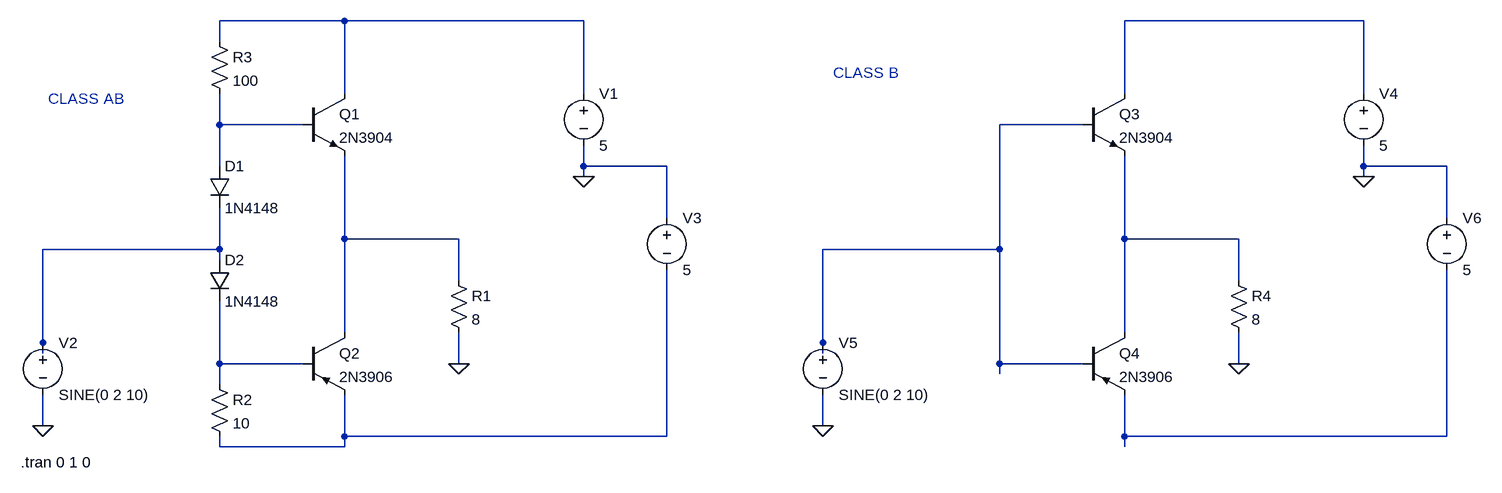
[diagram p0: schematic ClassBvsClassAB.asc]
ClassBvsClassAB.asc, the LTspice schematic file:
Version 4
SHEET 1 1948 680
WIRE 192 -96 0 -96
WIRE 560 -96 192 -96
WIRE 1760 -96 1392 -96
WIRE 0 -64 0 -96
WIRE 192 16 192 -96
WIRE 560 16 560 -96
WIRE 1392 16 1392 -96
WIRE 1760 16 1760 -96
WIRE 0 64 0 16
WIRE 128 64 0 64
WIRE 1328 64 1200 64
WIRE 0 128 0 64
WIRE 560 128 560 96
WIRE 688 128 560 128
WIRE 1760 128 1760 96
WIRE 1888 128 1760 128
WIRE 560 144 560 128
WIRE 1760 144 1760 128
WIRE 688 208 688 128
WIRE 1888 208 1888 128
WIRE 192 240 192 112
WIRE 368 240 192 240
WIRE 1392 240 1392 112
WIRE 1568 240 1392 240
WIRE 0 256 0 192
WIRE 0 256 -272 256
WIRE 1200 256 1200 64
WIRE 1200 256 928 256
WIRE 0 272 0 256
WIRE 368 304 368 240
WIRE 1568 304 1568 240
WIRE 192 384 192 240
WIRE 1392 384 1392 240
WIRE -272 400 -272 256
WIRE 928 400 928 256
WIRE -272 416 -272 400
WIRE 928 416 928 400
WIRE 0 432 0 336
WIRE 128 432 0 432
WIRE 368 432 368 384
WIRE 1200 432 1200 256
WIRE 1328 432 1200 432
WIRE 1568 432 1568 384
WIRE 1200 448 1200 432
WIRE 0 464 0 432
WIRE -272 528 -272 480
WIRE 928 528 928 480
WIRE 192 544 192 480
WIRE 688 544 688 288
WIRE 688 544 192 544
WIRE 1392 544 1392 480
WIRE 1888 544 1888 288
WIRE 1888 544 1392 544
WIRE 0 560 0 544
WIRE 192 560 192 544
WIRE 192 560 0 560
WIRE 1392 560 1392 544
FLAG 560 144 0
FLAG 368 432 0
FLAG -272 528 0
FLAG 1760 144 0
FLAG 1568 432 0
FLAG 928 528 0
SYMBOL npn2 128 16 R0
SYMATTR InstName Q1
SYMATTR Value 2N3904
SYMBOL pnp2 128 384 R0
SYMATTR InstName Q2
SYMATTR Value 2N3906
SYMBOL voltage 560 0 R0
WINDOW 123 0 0 Left 2
WINDOW 39 0 0 Left 2
SYMATTR InstName V1
SYMATTR Value 5
SYMBOL voltage -272 384 R0
WINDOW 123 0 0 Left 2
WINDOW 39 0 0 Left 2
SYMATTR InstName V2
SYMATTR Value SINE(0 2 10)
SYMBOL res 352 288 R0
SYMATTR InstName R1
SYMATTR Value 8
SYMBOL voltage 688 192 R0
WINDOW 123 0 0 Left 2
WINDOW 39 0 0 Left 2
SYMATTR InstName V3
SYMATTR Value 5
SYMBOL res -16 448 R0
SYMATTR InstName R2
SYMATTR Value 10
SYMBOL diode -16 128 R0
SYMATTR InstName D1
SYMATTR Value 1N4148
SYMBOL res -16 -80 R0
SYMATTR InstName R3
SYMATTR Value 100
SYMBOL diode -16 272 R0
SYMATTR InstName D2
SYMATTR Value 1N4148
SYMBOL npn2 1328 16 R0
SYMATTR InstName Q3
SYMATTR Value 2N3904
SYMBOL pnp2 1328 384 R0
SYMATTR InstName Q4
SYMATTR Value 2N3906
SYMBOL voltage 1760 0 R0
WINDOW 123 0 0 Left 2
WINDOW 39 0 0 Left 2
SYMATTR InstName V4
SYMATTR Value 5
SYMBOL voltage 928 384 R0
WINDOW 123 0 0 Left 2
WINDOW 39 0 0 Left 2
SYMATTR InstName V5
SYMATTR Value SINE(0 2 10)
SYMBOL res 1552 288 R0
SYMATTR InstName R4
SYMATTR Value 8
SYMBOL voltage 1888 192 R0
WINDOW 123 0 0 Left 2
WINDOW 39 0 0 Left 2
SYMATTR InstName V6
SYMATTR Value 5
TEXT -306 584 Left 2 !.tran 0 1 0
TEXT 944 -16 Left 2 ;CLASS B
TEXT -264 24 Left 2 ;CLASS AB

The netlist it stands for:
* ClassBvsClassAB.asc
Q1 N001 N003 N005 0 2N3904
Q2 N005 N008 N009 0 2N3906
V1 N001 0 5
V2 N007 0 SINE(0 2 10)
R1 N005 0 8
V3 0 N009 5
R2 N008 N009 10
D1 N003 N007 1N4148
R3 N001 N003 100
D2 N007 N008 1N4148
Q3 N002 N004 N006 0 2N3904
Q4 N006 N004 N010 0 2N3906
V4 N002 0 5
V5 N004 0 SINE(0 2 10)
R4 N006 0 8
V6 0 N010 5
.model D D
.lib standard.dio
.model NPN NPN
.model PNP PNP
.lib standard.bjt
.tran 0 1 0
* CLASS B
* CLASS AB
.backanno
.end